# Altium schematic sheet GALX4-0047N_PCB-1109N_REV-A_Master.SchDoc
size 431 x 279 mm
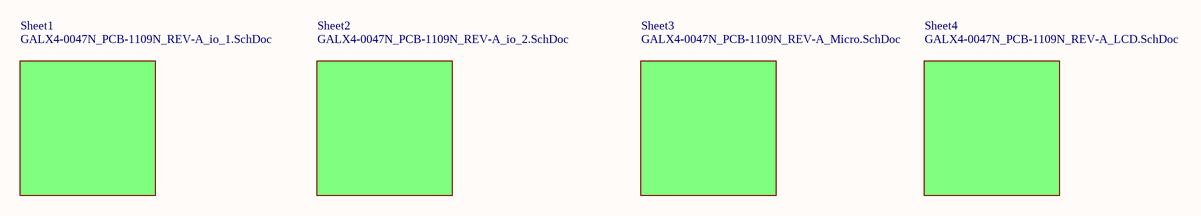
[diagram p0: GALX4-0047N_PCB-1109N_REV-A_Master.SchDoc]

## Sub-sheets
Sheet1 = GALX4-0047N_PCB-1109N_REV-A_io_1.SchDoc: no entries
Sheet2 = GALX4-0047N_PCB-1109N_REV-A_io_2.SchDoc: no entries
Sheet3 = GALX4-0047N_PCB-1109N_REV-A_Micro.SchDoc: no entries
Sheet4 = GALX4-0047N_PCB-1109N_REV-A_LCD.SchDoc: no entries